# EAGLE design caretaker-dimmer (EAGLE 6.5.0)
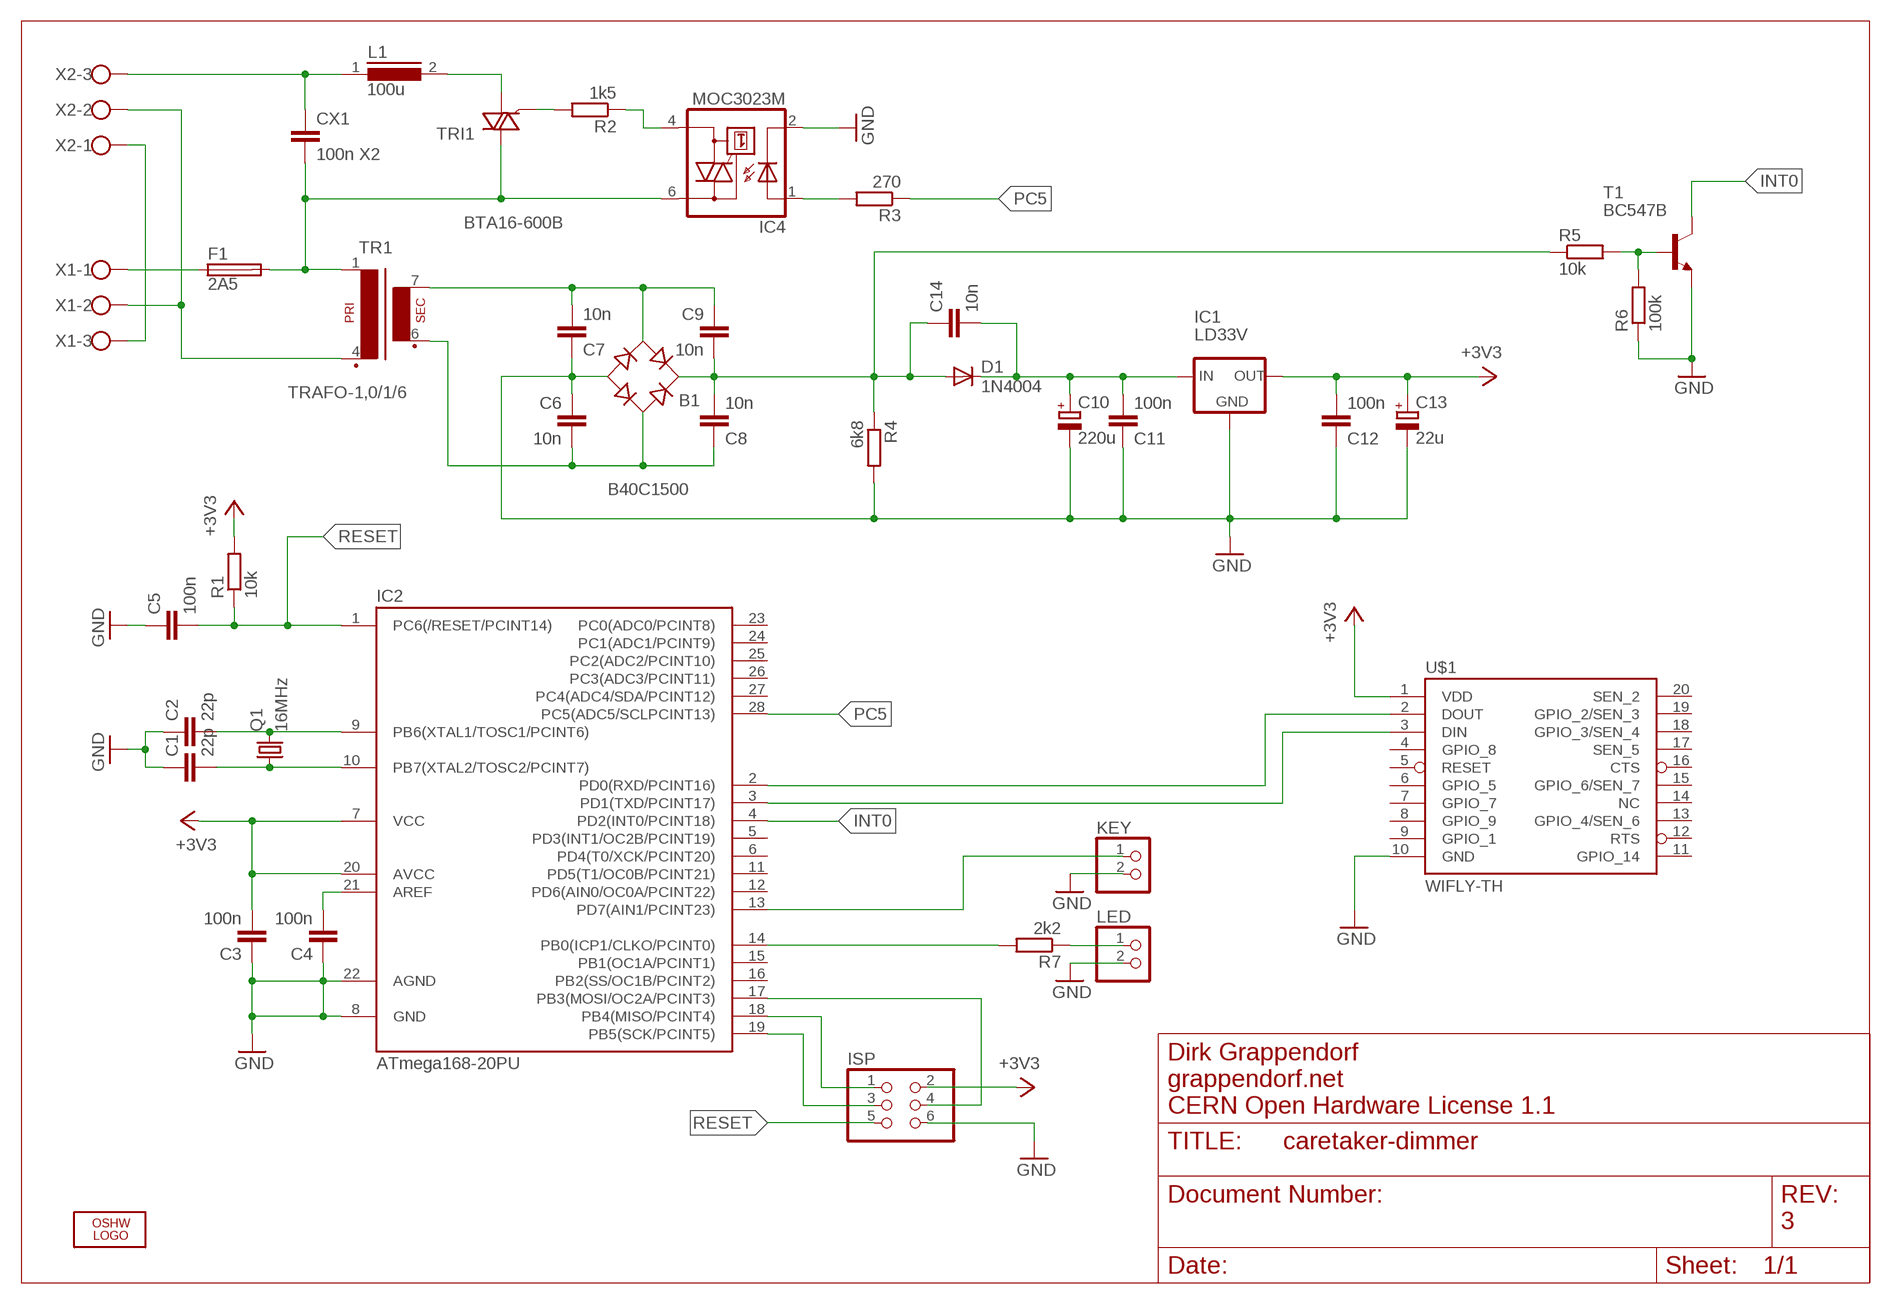
[diagram p0: schematic, sheet 1]

## Parts
B1  B40C1500  RECTIFIER-2KBB  [2KBB]
C1  22p  C-EU025-025X050  [C025-025X050]
C2  22p  C-EU025-025X050  [C025-025X050]
C3  100n  C-EU025-024X044  [C025-024X044]
C4  100n  C-EU025-024X044  [C025-024X044]
C5  100n  C-EU025-024X044  [C025-024X044]
C6  10n  C-EU025-024X044  [C025-024X044]
C7  10n  C-EU025-024X044  [C025-024X044]
C8  10n  C-EU025-024X044  [C025-024X044]
C9  10n  C-EU025-024X044  [C025-024X044]
C10  220u  CPOL-EUE3.5-8  [E3,5-8]
C11  100n  C-EU025-024X044  [C025-024X044]
C12  100n  C-EU025-024X044  [C025-024X044]
C13  22u  CPOL-EUE2.5-5  [E2,5-5]
C14  10n  C-EU025-024X044  [C025-024X044]
CX1  100n X2  CXXC15B10  [XC15B10]
D1  1N4004  DIODE-D-10  [D-10]
F1  2A5  SH22,5  [SH22,5]
IC1  LD33V  V_REG_LD1117VXX  [78XXL]
IC2  ATmega168-20PU  ATMEGA48/88/168-PU  [DIL28-3]
IC4  MOC3023M  [DIL06]
ISP  PINHD-2X3  [2X03]
KEY  PINHD-1X2  [1X02]
L1  100u  ED22  [ED22]
LED  PINHD-1X2  [1X02]
LOGO1  OSHW_LOGO_10MILX0350-NT-BOTTOM  [OSHW_10X350_NOTEXT_BOTTOM]
Q1  16MHz  CRYSTALHC49U-V  [HC49U-V]
R1  10k  R-EU_0204/7  [0204/7]
R2  1k5  R-EU_0204/7  [0204/7]
R3  270  R-EU_0204/7  [0204/7]
R4  6k8  R-EU_0204/7  [0204/7]
R5  10k  R-EU_0204/7  [0204/7]
R6  100k  R-EU_0204/7  [0204/7]
R7  2k2  R-EU_0204/7  [0204/7]
T1  BC547B  [TO92]
TR1  TRAFO-1,0/1/6  [TRAFO-1,0/1/6]
TRI1  BTA16-600B  BT136  [TO220AB]
U$1  WIFLY-TH  [WIFLY-TH]
X1  W237-103  [W237-103]
X2  W237-103  [W237-103]

## Nets
+3V3: C3.2 C12.2 C13.+ IC1.GND(OUT) IC2.7(VCC) IC2.20(AVCC) ISP.2 R1.2 U$1.1(VDD)
GND: B1.- C1.1 C2.1 C3.1 C4.1 C5.1 C6.1 C7.1 C10.- C11.1 C12.1 C13.- IC1.IN(GND) IC2.8(GND) IC2.22(AGND) IC4.2(C) ISP.6 KEY.2 LED.2 R4.2 R6.1 T1.1(E) U$1.10(GND)
INT0: IC2.4(PD2(INT0/PCINT18)) T1.3(C)
N$1: C2.2 IC2.9(PB6(XTAL1/TOSC1/PCINT6)) Q1.2
N$2: C1.2 IC2.10(PB7(XTAL2/TOSC2/PCINT7)) Q1.1
N$3: C4.2 IC2.21(AREF)
N$4: LED.1 R7.1
N$5: B1.AC1 C6.2 C8.1 TR1.6(S3)
N$6: R2.2 TRI1.3(G)
N$7: C10.+ C11.2 C14.2 D1.C IC1.OUT(IN)
N$8: B1.AC2 C7.2 C9.1 TR1.7(S4)
N$9: CX1.1 L1.1 X2.3
N$10: F1.1 X1.1
N$11: L1.2 TRI1.1(A1)
N$12: CX1.2 F1.2 IC4.6(A2) TR1.1 TRI1.2(A2)
N$13: TR1.4(P2) X1.2 X2.2
N$14: IC4.4(A1) R2.1
N$15: IC4.1(A) R3.2
N$17: IC2.2(PD0(RXD/PCINT16)) U$1.2(DOUT)
N$18: IC2.13(PD7(AIN1/PCINT23)) KEY.1
N$19: R5.2 R6.2 T1.2(B)
N$20: IC2.18(PB4(MISO/PCINT4)) ISP.1
N$21: IC2.19(PB5(SCK/PCINT5)) ISP.3
N$22: IC2.17(PB3(MOSI/OC2A/PCINT3)) ISP.4
N$23: IC2.14(PB0(ICP1/CLKO/PCINT0)) R7.2
N$24: X1.3 X2.1
N$29: IC2.3(PD1(TXD/PCINT17)) U$1.3(DIN)
N$30: B1.+ C8.2 C9.2 C14.1 D1.A R4.1 R5.1
PC5: IC2.28(PC5(ADC5/SCLPCINT13)) R3.1
RESET: C5.2 IC2.1(PC6(/RESET/PCINT14)) ISP.5 R1.1
Unconnected: IC2.5(PD3(INT1/OC2B/PCINT19)) IC2.6(PD4(T0/XCK/PCINT20)) IC2.11(PD5(T1/OC0B/PCINT21)) IC2.12(PD6(AIN0/OC0A/PCINT22)) IC2.15(PB1(OC1A/PCINT1)) IC2.16(PB2(SS/OC1B/PCINT2)) IC2.23(PC0(ADC0/PCINT8)) IC2.24(PC1(ADC1/PCINT9)) IC2.25(PC2(ADC2/PCINT10)) IC2.26(PC3(ADC3/PCINT11)) IC2.27(PC4(ADC4/SDA/PCINT12)) U$1.4(GPIO_8) U$1.5(RESET) U$1.6(GPIO_5) U$1.7(GPIO_7) U$1.8(GPIO_9) U$1.9(GPIO_1) U$1.11(GPIO_14) U$1.12(RTS) U$1.13(GPIO_4/SEN_6) U$1.14(NC) U$1.15(GPIO_6/SEN_7) U$1.16(CTS) U$1.17(SEN_5) U$1.18(GPIO_3/SEN_4) U$1.19(GPIO_2/SEN_3) U$1.20(SEN_2)

## Notes on the sheet
- Dirk Grappendorf
- grappendorf.net
- CERN Open Hardware License 1.1
- 3

## Library data of the parts
B1 = rectifier:RECTIFIER-: Rectifier
C1-C9 C11 C12 C14 = rcl:C-EU: CAPACITOR, European symbol
C10 C13 = rcl:CPOL-EU: POLARIZED CAPACITOR, European symbol
CX1 = rcl:CX: X CAPACITOR for power line
D1 = diode:DIODE-: DIODE
F1 = fuse:SH22,5: FUSE HOLDER grid 22,5 mm, OGN0031 8201, Schurter (Buerklin)
IC1 = SparkFun:V_REG_LD1117VXX: LD1117VXX voltage regulator. We carry the 3.3V version (COM-00526) in TO-220 package.
IC2 = atmega8:ATMEGA48/88/168-PU
IC4 = optocoupler:MOC30*M: RANDOM-PHASE OPTOISOLATORS TRIAC DRIVER OUTPUT Source: http://www.fairchildsemi.com MOC3020-M.pdf
ISP = pinhead:PINHD-2X3: PIN HEADER
KEY LED = pinhead:PINHD-1X2: PIN HEADER
L1 = inductors:ED22: INDUCTOR
LOGO1 = OSHW:OSHW_LOGO_10MIL
Q1 = crystal:CRYSTAL: CRYSTAL
R1-R7 = rcl:R-EU_: RESISTOR, European symbol
T1 = transistor-npn:BC547*: NPN Transistor
TR1 = grapelabs:TRAFO-1,0/1/6: TRANSFORMER 1 primary winding, 1 secondary winding BLOCK
TRI1 = triac:BT136: Triac BT136 series E sensitive gate Source: http://www.nxp.com/acrobat_download/datasheets/BT136_SERIES_E_2.pdf
U$1 = grapelabs:WIFLY
X1 X2 = con-wago-500:W237-103: WAGO SCREW CLAMP

## Board
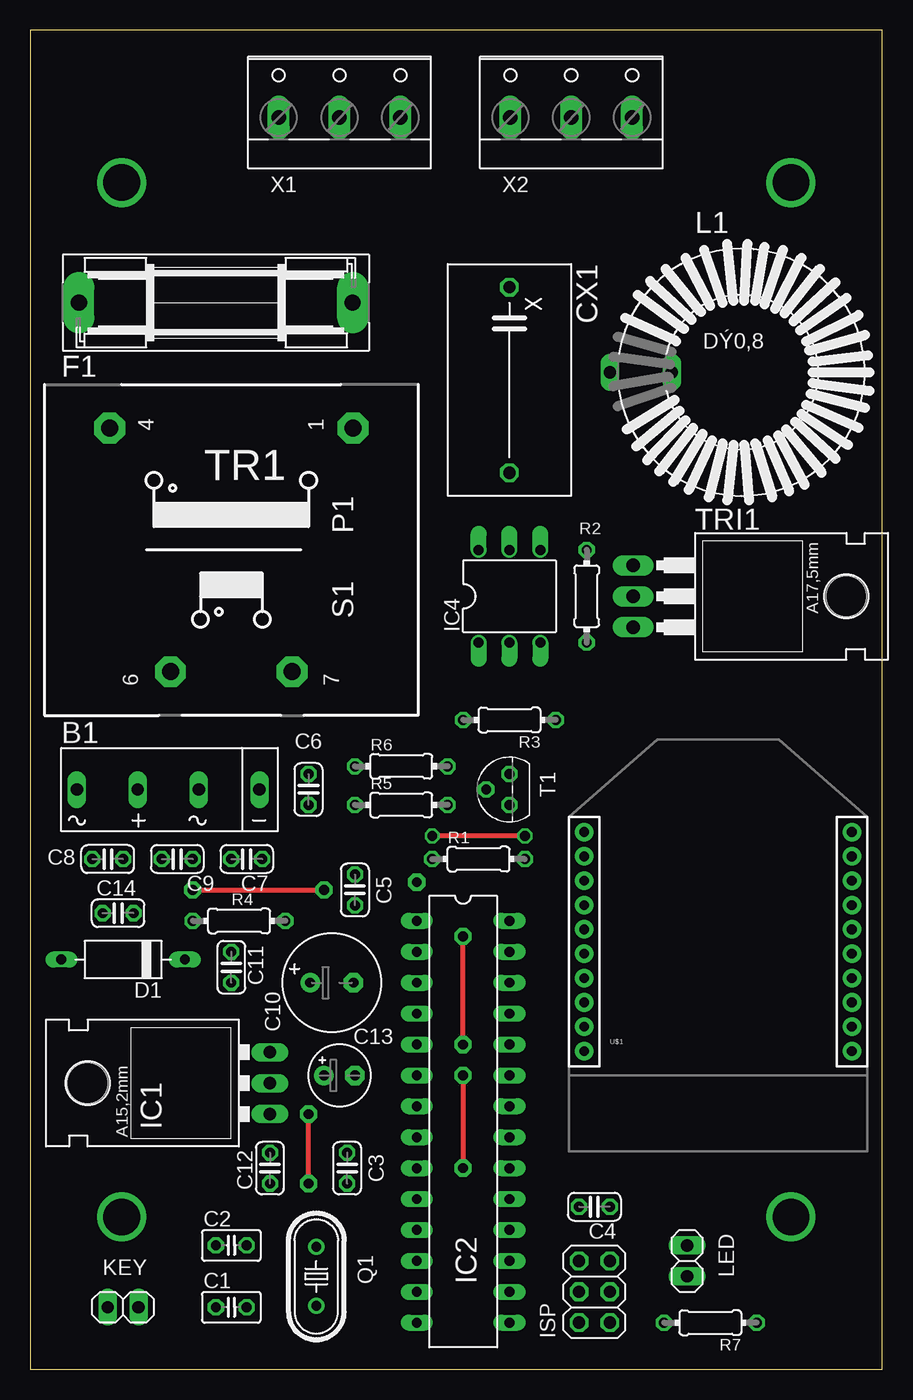
[diagram p1: board, top side]
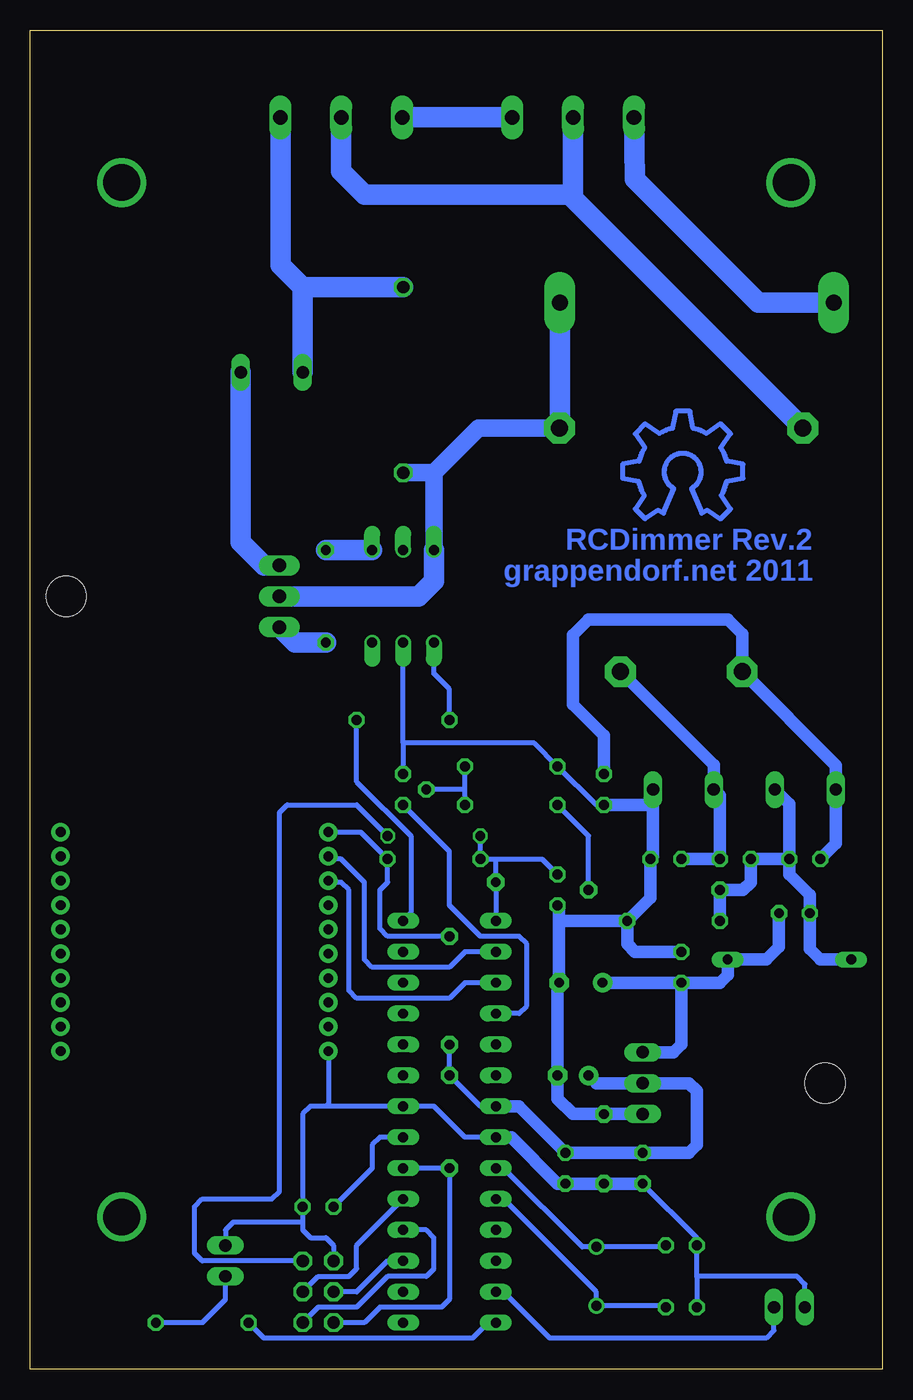
[diagram p2: board, bottom side, seen from below]

Size 70 x 110 mm. Coordinates in mm from the lower left corner, seen from the top.
Outline: 0,0 70,0 70,110 0,110 0,0
Copper layers (1*16): Top 0.035mm / dielectric 1.5mm / Bottom 0.035mm
Design rules "default": minimum track width 10mil, minimum drill 24mil, track to track 8mil, track to pad 8mil, pad to pad 8mil, via to via 8mil, smd to smd 8mil, copper to edge 40mil, drill to drill 8mil, minimum pad ring 10mil, minimum via ring 8mil, stop-mask expansion 4mil, vias tented up to drill 0mil, thermal gap 10mil

### Footprints (pad centres in the part's own frame; a part is rotated, then mirrored left to right if it is on the bottom)
2KBB = drill 1.016 long: + -2.616,0; - 7.391,0; AC1 -7.62,0; AC2 2.413,0
C025-025X050 = drill 0.813 octagon: 1 -1.27,0; 2 1.27,0
C025-024X044 = drill 0.813 octagon: 1 -1.27,0; 2 1.27,0
E3,5-8 = drill 0.813 pad 1.6: + -1.778,0 | drill 0.813 pad 1.6 octagon: - 1.778,0
E2,5-5 = drill 0.813 pad 1.6: + -1.27,0 | drill 0.813 pad 1.6 octagon: - 1.27,0
XC15B10 = drill 1.016 octagon: 1 -7.62,0; 2 7.62,0
D-10 = drill 0.813 long: A 5.08,0; C -5.08,0
SH22,5 = drill 1.321 pad 2.54 long: 1 -11.252,0; 2 11.252,0
78XXL = drill 1.016 long: GND 0,-3.81; IN -2.54,-3.81; OUT 2.54,-3.81 | hole 3.302: 0,11.176
DIL28-3 = drill 0.813 long: 1 -16.51,-3.81; 2 -13.97,-3.81; 3 -11.43,-3.81; 4 -8.89,-3.81; 5 -6.35,-3.81; 6 -3.81,-3.81; 7 -1.27,-3.81; 8 1.27,-3.81; 9 3.81,-3.81; 10 6.35,-3.81; 11 8.89,-3.81; 12 11.43,-3.81; 13 13.97,-3.81; 14 16.51,-3.81; 15 16.51,3.81; 16 13.97,3.81; 17 11.43,3.81; 18 8.89,3.81; 19 6.35,3.81; 20 3.81,3.81; 21 1.27,3.81; 22 -1.27,3.81; 23 -3.81,3.81; 24 -6.35,3.81; 25 -8.89,3.81; 26 -11.43,3.81; 27 -13.97,3.81; 28 -16.51,3.81
DIL06 = drill 0.813 offset: 1 -2.54,-3.81; 2 0,-3.81; 3 2.54,-3.81; 4 2.54,3.81; 5 0,3.81; 6 -2.54,3.81
2X03 = drill 1.016 octagon: 1 -2.54,-1.27; 2 -2.54,1.27; 3 0,-1.27; 4 0,1.27; 5 2.54,-1.27; 6 2.54,1.27
1X02 = drill 1.016 long: 1 -1.27,0; 2 1.27,0
ED22 = drill 1.016 long: 1 -10.795,0; 2 -5.715,0
HC49U-V = drill 0.813: 1 -2.413,0; 2 2.413,0
0204/7 = drill 0.813 octagon: 1 -3.81,0; 2 3.81,0
TO92 = drill 0.813 octagon: 1 1.27,0; 2 0,1.905; 3 -1.27,0
TRAFO-1,0/1/6 = drill 1.397 pad 2.54 octagon: 1 -10.008,10.008; 4 -10.008,-10.008; 6 10.008,-5.004; 7 10.008,5.004
TO220AB = drill 1.118 long: 1 -2.54,-6.35; 2 0,-6.35; 3 2.54,-6.35 | hole 3.302: 0,11.176
WIFLY-TH = drill 0.8 pad 1.524: 1 -11,20; 2 -11,18; 3 -11,16; 4 -11,14; 5 -11,12; 6 -11,10; 7 -11,8; 8 -11,6; 9 -11,4; 10 -11,2; 11 11,2; 12 11,4; 13 11,6; 14 11,8; 15 11,10; 16 11,12; 17 11,14; 18 11,16; 19 11,18; 20 11,20
W237-103 = drill 1.194 long: 1 -5,-1.29; 2 0,-1.29; 3 5,-1.29

### Placement (x,y rotation side)
B1  11.43,47.62 0 top
C1  16.51,5.08 0 top
C2  16.51,10.16 0 top
C3  26.04,16.51 90 top
C4  46.35,13.34 180 top
C5  26.67,39.37 90 top
C6  22.86,47.62 90 top
C7  17.78,41.91 180 top
C8  6.35,41.91 0 top
C9  12.06,41.91 180 top
C10  24.77,31.75 0 top
C11  16.51,33.02 270 top
C12  19.68,16.51 90 top
C13  25.4,24.13 0 top
C14  7.2,37.46 0 top
CX1  39.37,81.28 270 top
D1  7.62,33.66 180 top
F1  15.24,87.63 0 top
IC1  15.88,23.5 90 top
IC2  35.56,20.32 270 top
IC4  39.37,63.5 0 top
ISP  46.35,6.35 90 top
KEY  7.62,5.08 180 top
L1  58.42,81.92 0 top
LED  53.98,8.89 90 top
LOGO1  16.51,73.66 0 top
Q1  23.5,7.62 90 top
R1  36.83,41.91 0 top
R2  45.72,63.5 270 top
R3  39.37,53.34 180 top
R4  17.14,36.83 0 top
R5  30.48,46.35 0 top
R6  30.48,49.53 0 top
R7  55.88,3.81 180 top
T1  39.37,47.62 90 top
TR1  16.51,67.31 270 top
TRI1  55.88,63.5 270 top
U$1  56.52,24.13 0 top
X1  25.4,104.14 0 top
X2  44.45,104.14 0 top

### Tracks (layer width: path | path; a pad name or v marks a point on that pad's centre or on a via)
+3V3  (via drill 0.8 pad 1.42)
  Top 0.406: v35.56,24.13 v35.56,16.51 | v35.56,26.67 v35.56,35.56
  Bottom 0.406: IC2.7 33.02,21.59 v35.56,24.13 v35.56,26.67 | v35.56,16.51 36.2,16.51 | 36.2,16.51 IC2.20 | 36.2,16.51 35.56,15.88 35.56,5.71 36.2,5.08 41.27,5.08 42.55,3.81 ISP.2 | v35.56,35.56 40.64,35.56 41.27,36.2 41.27,39.37 40.64,40.01 R1.2 42.86,44.13 U$1.1
  Bottom 1.016: C13.+ 23.5,23.5 IC1.GND 15.88,23.5 15.24,22.86 15.24,18.41 15.88,17.78 C12.2 C3.2 29.84,21.59 IC2.7
GND  (via drill 0.8 pad 1.42)
  Top 0.406: v22.86,15.24 v22.86,20.95
  Bottom 0.406: 15.24,7.62 C1.1 | 15.24,7.62 C2.1 15.24,10.79 C12.1 | IC2.8 34.29,19.05 36.83,21.59 IC2.22 45.72,21.59 | LED.2 53.98,11.43 53.34,12.06 47.62,12.06 | C6.1 23.5,46.35 R6.1 28.57,51.44 39.37,51.44 | KEY.2 6.35,6.99 6.99,7.62 15.24,7.62 | 47.62,12.06 C4.1 47.62,20.95 46.99,21.59 45.72,21.59 | ISP.6 45.09,10.16 45.72,10.79 46.99,10.79 47.62,11.43 47.62,12.06 | 39.37,51.44 T1.1 | 39.37,51.44 IC4.2 | U$1.10 45.52,21.8 45.72,21.59
  Bottom 1.016: 26.54,36.83 C10.- 26.67,31.62 C13.- 26.67,22.23 25.4,20.95 v22.86,20.95 IC1.IN | 26.54,36.83 26.54,37.97 C5.1 | C11.1 20.32,34.29 20.95,34.92 R4.2 | 26.54,36.83 R4.2 | C12.1 v22.86,15.24 C3.1 26.67,15.24 30.48,19.05 IC2.8 | 19.05,47.62 B1.- 18.82,46.35 | 18.82,46.35 18.82,42.14 C7.1 19.05,38.73 R4.2 | 18.82,46.35 C6.1
INT0
  Bottom 0.406: IC2.4 29.84,29.21 29.21,29.84 29.21,34.92 29.84,35.56 33.02,35.56 35.56,38.1 35.56,42.55 T1.3
N$1
  Bottom 0.406: C2.2 17.91,10.03 Q1.2 24.64,10.03 31.11,16.51 IC2.9
N$2
  Bottom 0.406: C1.2 17.91,5.21 Q1.1 23.5,6.35 31.11,13.97 IC2.10
N$3
  Bottom 0.406: IC2.21 41.27,19.05 41.91,18.41 41.91,16.51 C4.2
N$4
  Bottom 0.406: LED.1 53.98,5.71 55.88,3.81 R7.1
N$5
  Bottom 1.016: C6.2 22.86,52.07 25.4,54.61 25.4,60.33 24.13,61.59 12.7,61.59 11.51,60.4 TR1.6 3.81,49.61 B1.AC1 3.81,43.18 C8.1
N$6
  Bottom 1.676: R2.2 48.26,59.69 TRI1.3
N$7
  Bottom 1.016: C11.2 16.51,26.67 17.14,26.04 IC1.OUT | C11.2 C10.+ | C14.2 8.47,34.71 9.53,33.66 D1.C 12.7,32.38 13.34,31.75 C11.2
N$8
  Bottom 1.016: C7.2 C9.1 13.34,47.12 B1.AC2 13.84,49.63 TR1.7
N$9
  Bottom 1.676: X2.3 49.45,90.72 47.94,89.22 47.62,88.9 | 47.62,88.9 CX1.1 | L1.1 47.62,88.9
N$10
  Bottom 1.676: X1.1 20.3,97.77 10.16,87.63 F1.1
N$11
  Bottom 1.676: L1.2 52.7,67.94 50.8,66.04 TRI1.1
N$12
  Bottom 1.422: TR1.1 33.17,77.32 36.83,73.66 | 36.83,73.66 CX1.2 | IC4.6 36.83,73.66
  Bottom 1.676: F1.2 26.49,77.34 TR1.1 | TRI1.2 38.1,63.5 36.83,64.77 IC4.6
N$13
  Bottom 1.676: 25.4,96.52 25.4,96.22 TR1.4 | 25.4,96.52 X1.2 | X2.2 44.45,98.42 42.55,96.52 25.4,96.52
N$14
  Bottom 1.676: IC4.4 R2.1
N$15
  Bottom 0.406: R3.2 35.56,55.88 36.83,57.15 IC4.1
N$17
  Bottom 0.406: IC2.2 34.29,34.29 35.56,33.02 41.91,33.02 42.55,33.66 42.55,40.01 44.45,41.91 45.3,41.91 | 45.3,41.91 U$1.2 45.3,41.91
N$18
  Bottom 0.406: IC2.13 31.11,6.35 27.3,2.54 9.53,2.54 8.89,3.17 KEY.1
N$19
  Bottom 0.406: R5.2 34.29,47.62 | 34.29,47.62 R6.2 | 34.29,47.62 T1.2
N$20
  Bottom 0.406: ISP.1 46.35,5.08 43.18,5.08 40.64,7.62 37.47,7.62 36.83,8.26 36.83,10.79 37.47,11.43 IC2.18
N$21
  Bottom 0.406: IC2.19 43.18,10.16 43.18,8.26 43.81,7.62 46.35,7.62 ISP.3
N$22
  Bottom 0.406: IC2.17 40.64,8.89 43.18,6.35 ISP.4
N$23
  Bottom 0.406: IC2.14 32.38,3.81 33.66,2.54 50.8,2.54 R7.2
N$24
  Bottom 1.676: X1.3 X2.1
N$25  (via drill 3 pad 2)
  other vias: 7.5,97.5
N$26  (via drill 3 pad 2)
  other vias: 62.5,12.5
N$27  (via drill 3 pad 2)
  other vias: 7.5,12.5
N$28  (via drill 3 pad 2)
  other vias: 62.5,97.5
N$29
  Bottom 0.406: IC2.3 34.29,31.75 35.56,30.48 43.18,30.48 43.81,31.11 43.81,39.37 44.45,40.01 45.39,40.01 U$1.3
N$30  (via drill 0.8 pad 1.42)
  Top 0.406: v13.34,39.37 v24.13,39.37
  Bottom 0.406: R5.1 24.13,43.81 v24.13,39.37
  Bottom 1.016: D1.A 5.08,33.66 5.93,34.51 C14.1 5.93,38.95 7.62,40.64 C8.2 | R4.1 v13.34,39.37 11.43,39.37 10.79,40.01 C9.2 C8.2 | C8.2 7.62,46.43 B1.+
PC5
  Bottom 0.406: R3.1 43.18,48.26 38.73,43.81 38.73,37.47 IC2.28
RESET  (via drill 0.8, 0.8 pad 1.42)
  Top 0.406: v40.64,43.81 v33.02,43.81
  Bottom 0.406: 31.75,41.91 27.94,41.91 C5.2 | IC2.1 v31.75,40.01 31.75,41.91 | ISP.5 55.88,8.89 56.52,9.53 56.52,13.34 55.88,13.97 50.16,13.97 49.53,14.61 49.53,45.72 48.9,46.35 43.18,46.35 v40.64,43.81 | 31.75,41.91 R1.1 v33.02,43.81

### Text on the board
Bottom: RCDimmer Rev.2 | grappendorf.net 2011